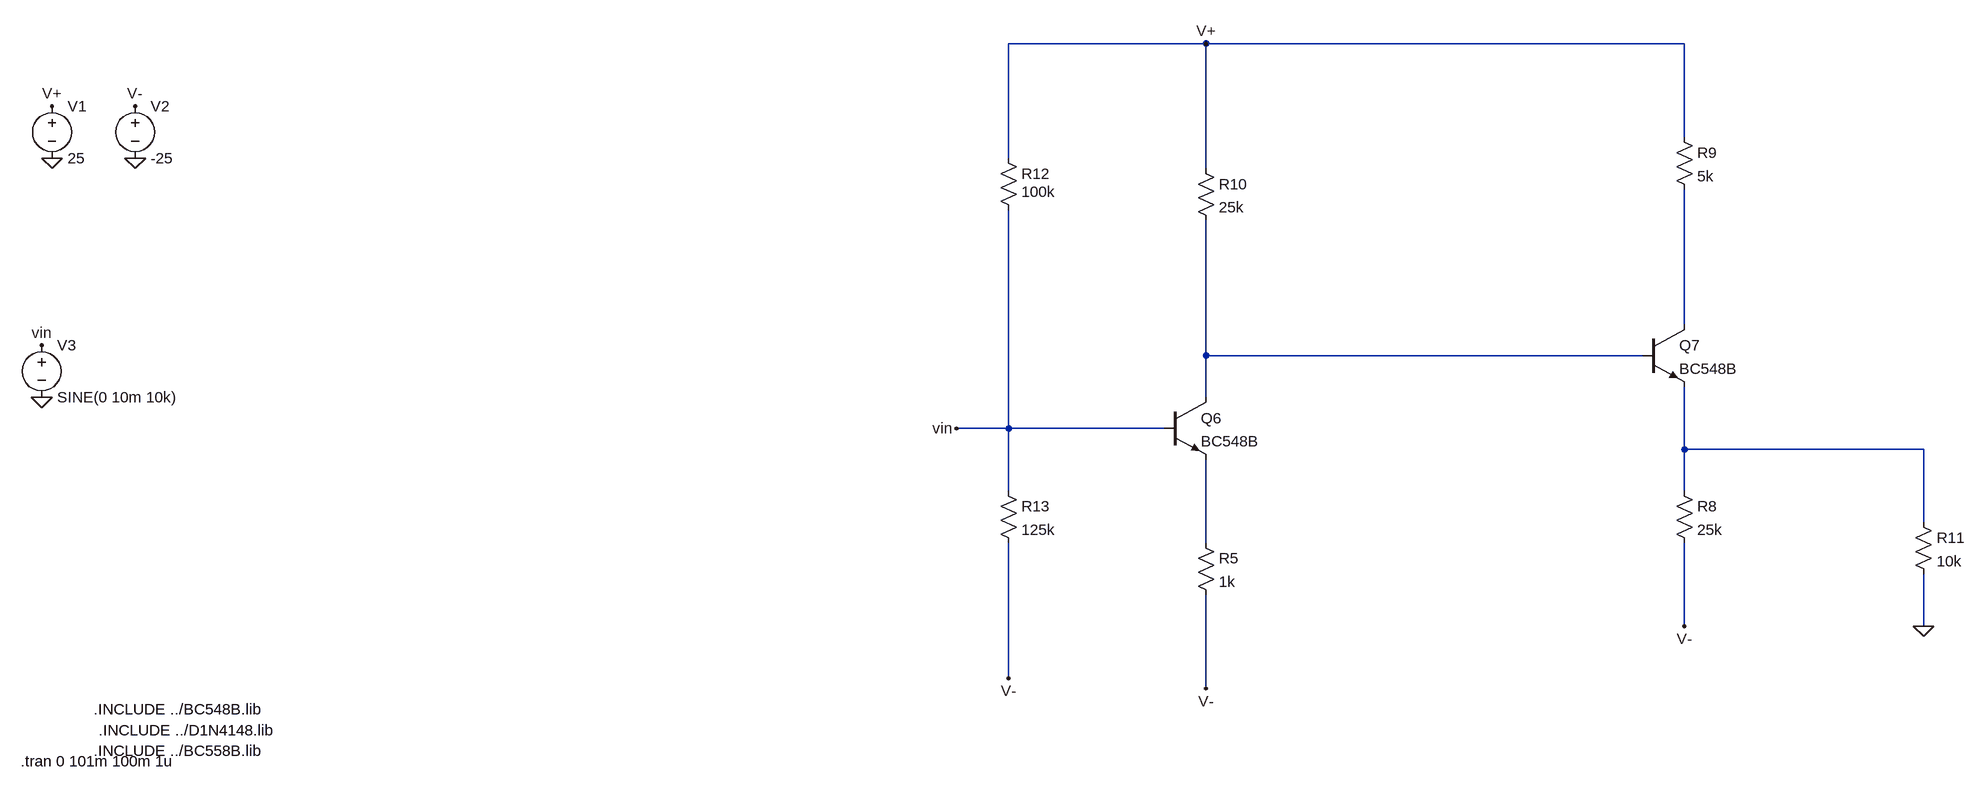
[diagram p0: schematic vas.asc]
vas.asc, the LTspice schematic file:
Version 4
SHEET 1 4564 1376
WIRE 3392 -1312 3088 -1312
WIRE 4128 -1312 3392 -1312
WIRE 4128 -1168 4128 -1312
WIRE 3088 -1136 3088 -1312
WIRE 3392 -1120 3392 -1312
WIRE 4128 -880 4128 -1088
WIRE 3392 -832 3392 -1040
WIRE 4064 -832 3392 -832
WIRE 3392 -768 3392 -832
WIRE 3088 -720 3088 -1056
WIRE 3088 -720 3008 -720
WIRE 3328 -720 3088 -720
WIRE 4128 -688 4128 -784
WIRE 4496 -688 4128 -688
WIRE 3088 -624 3088 -720
WIRE 4128 -624 4128 -688
WIRE 4496 -576 4496 -688
WIRE 3392 -544 3392 -672
WIRE 4128 -416 4128 -544
WIRE 4496 -416 4496 -496
WIRE 3088 -336 3088 -544
WIRE 3392 -320 3392 -464
FLAG 1616 -1216 V+
FLAG 1744 -1216 V-
FLAG 1600 -848 vin
FLAG 1744 -1136 0
FLAG 1616 -1136 0
FLAG 1600 -768 0
FLAG 4496 -416 0
FLAG 3392 -1312 V+
FLAG 3392 -320 V-
FLAG 3088 -336 V-
FLAG 4128 -416 V-
FLAG 3008 -720 vin
SYMBOL voltage 1616 -1232 R0
WINDOW 123 0 0 Left 2
WINDOW 39 0 0 Left 2
SYMATTR InstName V1
SYMATTR Value 25
SYMBOL voltage 1744 -1232 R0
WINDOW 123 0 0 Left 2
WINDOW 39 0 0 Left 2
SYMATTR InstName V2
SYMATTR Value -25
SYMBOL voltage 1600 -864 R0
WINDOW 123 0 0 Left 2
WINDOW 39 0 0 Left 2
SYMATTR InstName V3
SYMATTR Value SINE(0 10m 10k)
SYMBOL npn 3328 -768 R0
SYMATTR InstName Q6
SYMATTR Value BC548B
SYMBOL npn 4064 -880 R0
SYMATTR InstName Q7
SYMATTR Value BC548B
SYMBOL res 3376 -560 R0
SYMATTR InstName R5
SYMATTR Value 1k
SYMBOL res 4112 -640 R0
SYMATTR InstName R8
SYMATTR Value 25k
SYMBOL res 4112 -1184 R0
SYMATTR InstName R9
SYMATTR Value 5k
SYMBOL res 3376 -1136 R0
SYMATTR InstName R10
SYMATTR Value 25k
SYMBOL res 4480 -592 R0
SYMATTR InstName R11
SYMATTR Value 10k
SYMBOL res 3072 -1152 R0
WINDOW 3 36 68 Left 2
SYMATTR Value 100k
SYMATTR InstName R12
SYMBOL res 3072 -640 R0
SYMATTR InstName R13
SYMATTR Value 125k
TEXT 1680 -288 Left 2 !.INCLUDE ../BC548B.lib
TEXT 1688 -256 Left 2 !.INCLUDE ../D1N4148.lib
TEXT 1680 -224 Left 2 !.INCLUDE ../BC558B.lib
TEXT 1568 -208 Left 2 !.tran 0 101m 100m 1u

The netlist it stands for:
* vas.asc
V1 V+ 0 25
V2 V- 0 -25
V3 vin 0 SINE(0 10m 10k)
Q6 N002 vin N004 0 BC548B
Q7 N001 N002 N003 0 BC548B
R5 N004 V- 1k
R8 N003 V- 25k
R9 V+ N001 5k
R10 V+ N002 25k
R11 N003 0 10k
R12 V+ vin 100k
R13 vin V- 125k
.model NPN NPN
.model PNP PNP
.lib standard.bjt
.INCLUDE ../BC548B.lib
.INCLUDE ../D1N4148.lib
.INCLUDE ../BC558B.lib
.tran 0 101m 100m 1u
.backanno
.end